# EAGLE design minDUINO v1.6 (EAGLE 6.3)
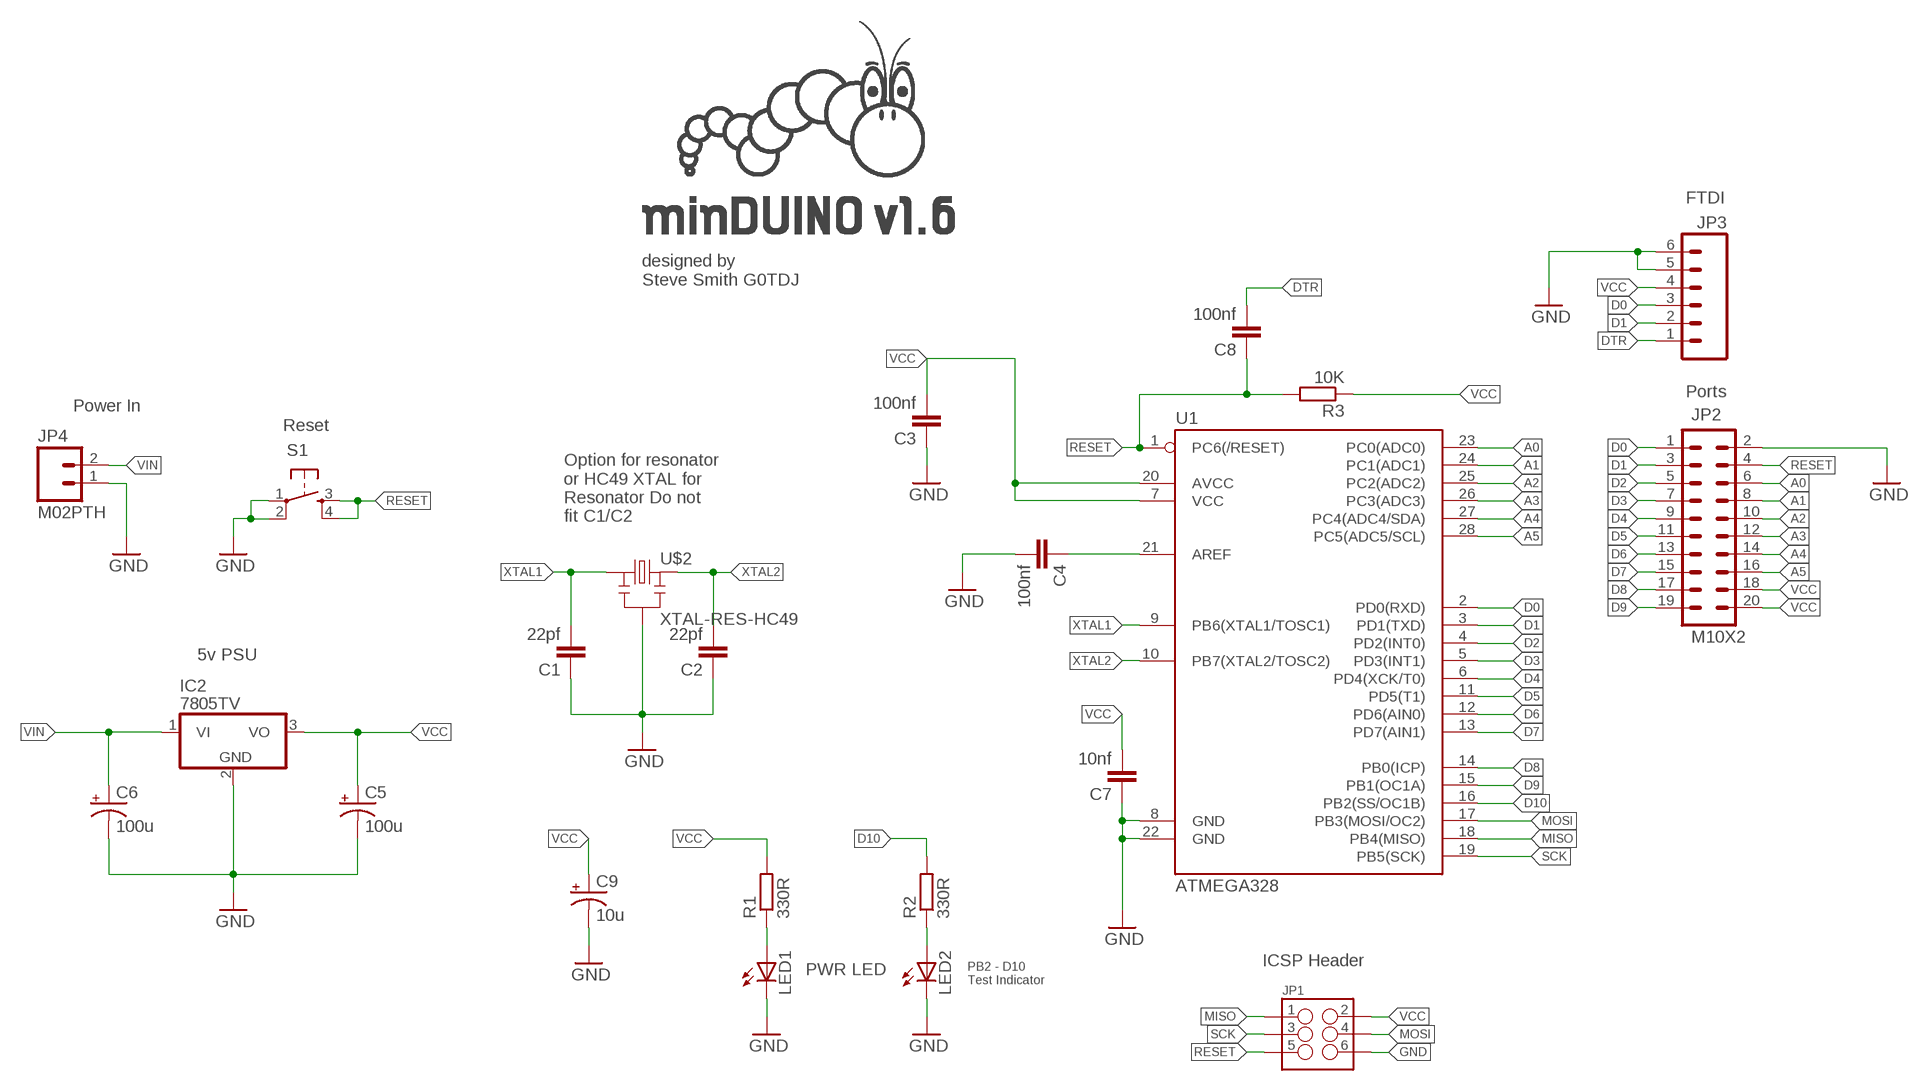
[diagram p0: schematic, sheet 1]

## Parts
C1  22pf  C-EU050-030X075  [C050-030X075]
C2  22pf  C-EU050-030X075  [C050-030X075]
C3  100nf  C-EU050-030X075  [C050-030X075]
C4  100nf  C-EU050-030X075  [C050-030X075]
C5  100u  CAP_POLPTH1  [CPOL-RADIAL-100UF-25V]
C6  100u  CAP_POLPTH1  [CPOL-RADIAL-100UF-25V]
C7  10nf  C-EU050-030X075  [C050-030X075]
C8  100nf  C-EU050-030X075  [C050-030X075]
C9  10u  CAP_POLPTH1  [CPOL-RADIAL-100UF-25V]
IC2  7805TV  [TO220V]
JP1  M03X2SHROUD  [2X3-SHROUDED]
JP2  M10X2  [2X10]
JP3  M06SIP  [1X06]
JP4  M02PTH  [1X02]
LED1  LED3MM  [LED3MM]
LED2  LED3MM  [LED3MM]
R1  330R  R-EU_0411/3V  [0411V]
R2  330R  R-EU_0411/3V  [0411V]
R3  10K  R-EU_0411/3V  [0411V]
S1  TAC_SWITCHPTH  [TACTILE-PTH]
U1  ATMEGA328  [DIL28-3]
U$1  MINDUINO_WORDMARK_V1.6  [MINDUINO_WORDMARK_V1.6]
U$2  XTAL-RES-HC49  [XTAL-RES-HC49]
U$4  MINDUINO_CATERPILLAR  [MINDUINO_CATERPILLAR]

## Nets
A0: JP2.6 U1.23(PC0(ADC0))
A1: JP2.8 U1.24(PC1(ADC1))
A2: JP2.10 U1.25(PC2(ADC2))
A3: JP2.12 U1.26(PC3(ADC3))
A4: JP2.14 U1.27(PC4(ADC4/SDA))
A5: JP2.16 U1.28(PC5(ADC5/SCL))
D0: JP2.1 JP3.3 U1.2(PD0(RXD))
D1: JP2.3 JP3.2 U1.3(PD1(TXD))
D2: JP2.5 U1.4(PD2(INT0))
D3: JP2.7 U1.5(PD3(INT1))
D4: JP2.9 U1.6(PD4(XCK/T0))
D5: JP2.11 U1.11(PD5(T1))
D6: JP2.13 U1.12(PD6(AIN0))
D7: JP2.15 U1.13(PD7(AIN1))
D8: JP2.17 U1.14(PB0(ICP))
D9: JP2.19 U1.15(PB1(OC1A))
D10: R2.2 U1.16(PB2(SS/OC1B))
DTR: C8.2 JP3.1
GND: C1.1 C2.1 C3.1 C4.2 C5.2(-) C6.2(-) C7.1 C9.2(-) IC2.2(GND) JP1.6 JP2.2 JP3.5 JP3.6 JP4.1 LED1.K(C) LED2.K(C) S1.1 S1.2 U1.8(GND) U1.22(GND) U$2.2
MISO: JP1.1 U1.18(PB4(MISO))
MOSI: JP1.4 U1.17(PB3(MOSI/OC2))
N$4: LED2.A R2.1
N$6: C4.1 U1.21(AREF)
N$23: LED1.A R1.1
RESET: C8.1 JP1.5 JP2.4 R3.2 S1.3 S1.4 U1.1(PC6(/RESET))
SCK: JP1.3 U1.19(PB5(SCK))
VCC: C3.2 C5.1(+) C7.2 C9.1(+) IC2.3(VO) JP1.2 JP2.18 JP2.20 JP3.4 R1.2 R3.1 U1.7(VCC) U1.20(AVCC)
VIN: C6.1(+) IC2.1(VI) JP4.2
XTAL1: C1.2 U1.9(PB6(XTAL1/TOSC1)) U$2.1
XTAL2: C2.2 U1.10(PB7(XTAL2/TOSC2)) U$2.3

## Notes on the sheet
- FTDI
- designed by
  Steve Smith G0TDJ
- Ports
- Power In
- Reset
- Option for resonator
  or HC49 XTAL for
  Resonator Do not
  fit C1/C2
- 5v PSU
- ICSP Header
- PWR LED
- PB2 - D10
  Test Indicator

## Library data of the parts
C1-C4 C7 C8 = resistor:C-EU: CAPACITOR, European symbol
C5 C6 C9 = SparkFun-Capacitors:CAP_POL: Capacitor Polarized These are standard SMD and PTH capacitors. Normally 10uF, 47uF, and 100uF in electrolytic and tantalum varieties. Always verify the external diameter of the through hole cap, it varies with capacity, voltage, and manufacturer. The EIA devices should be standard.
IC2 = linear:78*: Positive VOLTAGE REGULATOR Source: http://cache.national.com/ds/LM/LM78L05.pdf http://www.fairchildsemi.com/ds/LM/LM7805.pdf
JP1 = SparkFun-Connectors:M03X2: 2x3 .1" header. Shrouded, with keying- CONN-10681 SMT- CONN-11415 Pogo pins- HW-11044; PROD_ID: CONN-10681
JP2 = SparkFun-Connectors:M10X2: This was SPECIALLY designed to be used with our Graphic LCD Backpack. Be sure you want to use this! It is not only staggered on each line of header holes, but IT IS ALSO offset of the center point of the top and bottom lines by 5 mil. This causes the headers to lock into place on the "standard" footprint on the LCD screen. The extra squares on the tdocu layer are there simply to reference other pins (if you were to actually populate a longer header than ten long - this is what we do with the backpacks).
JP3 = SparkFun-Connectors:M06: Header 6 Standard 6-pin 0.1" header. Use with straight break away headers (SKU : PRT-00116), right angle break away headers (PRT-00553), swiss pins (PRT-00743), machine pins (PRT-00117), and female headers (PRT-00115). Molex polarized connector foot print use with SKU : PRT-08094 with associated crimp pins and housings. NOTES ON THE VARIANTS LOCK and LOCK_LONGPADS... This footprint was designed to help hold the alignment of a through-hole component (i.e. 6-pin header) while soldering it into place. You may notice that each hole has been shifted either up or down by 0.005 of an inch from it's more standard position (which is a perfectly straight line). This slight alteration caused the pins (the squares in the middle) to touch the edges of the holes. Because they are alternating, it causes a "brace" to hold the component in place. 0.005 has proven to be the perfect amount of "off-center" position when using our standard breakaway headers. Although looks a little odd when you look at the bare footprint, once you have a header in there, the alteration is very hard to notice. Also,if you push a header all the way into place, it is covered up entirely on the bottom side. This idea of altering the position of holes to aid alignment will be further integrated into the Sparkfun Library for other footprints. It can help hold any component with 3 or more connection pins.
JP4 = SparkFun-Connectors:M02: Standard 2-pin 0.1" header. Use with - straight break away headers ( PRT-00116) - right angle break away headers (PRT-00553) - swiss pins (PRT-00743) - machine pins (PRT-00117) - female headers (PRT-00115) Molex polarized connector foot print use with: PRT-08233 with associated crimp pins and housings. 2.54_SCREWTERM for use with PRT-10571. 3.5mm Screw Terminal footprints for PRT-08084 5mm Screw Terminal footprints for use with PRT-08433
LED1 LED2 = SparkFun-LED:LED: LEDs Standard schematic elements and footprints for 5mm, 3mm, 1206, and 0603 sized LEDs. 5mm - Spark Fun Electronics SKU : COM-00529 (and others)
R1-R3 = resistor:R-EU_: RESISTOR, European symbol
S1 = SparkFun-Electromechanical:TAC_SWITCH: Momentary Switch Button commonly used for reset or general input. Spark Fun Electronics SKU : COM-00097 SMT- SWCH-08247
U1 = 00_G0TDJ:ATMEGA328: uC used in the Arduino 32k flash, 1k EPROM, 2k SRAM Through hole version with extra wide holes for ZIF Socket
U$1 = 00_G0TDJ:MINDUINO_WORDMARK_V1.6
U$2 = 00_G0TDJ:XTAL-RES-HC49: Resonator footprint with HC49 outline
U$4 = 00_G0TDJ:MINDUINO_CATERPILLAR

## Board
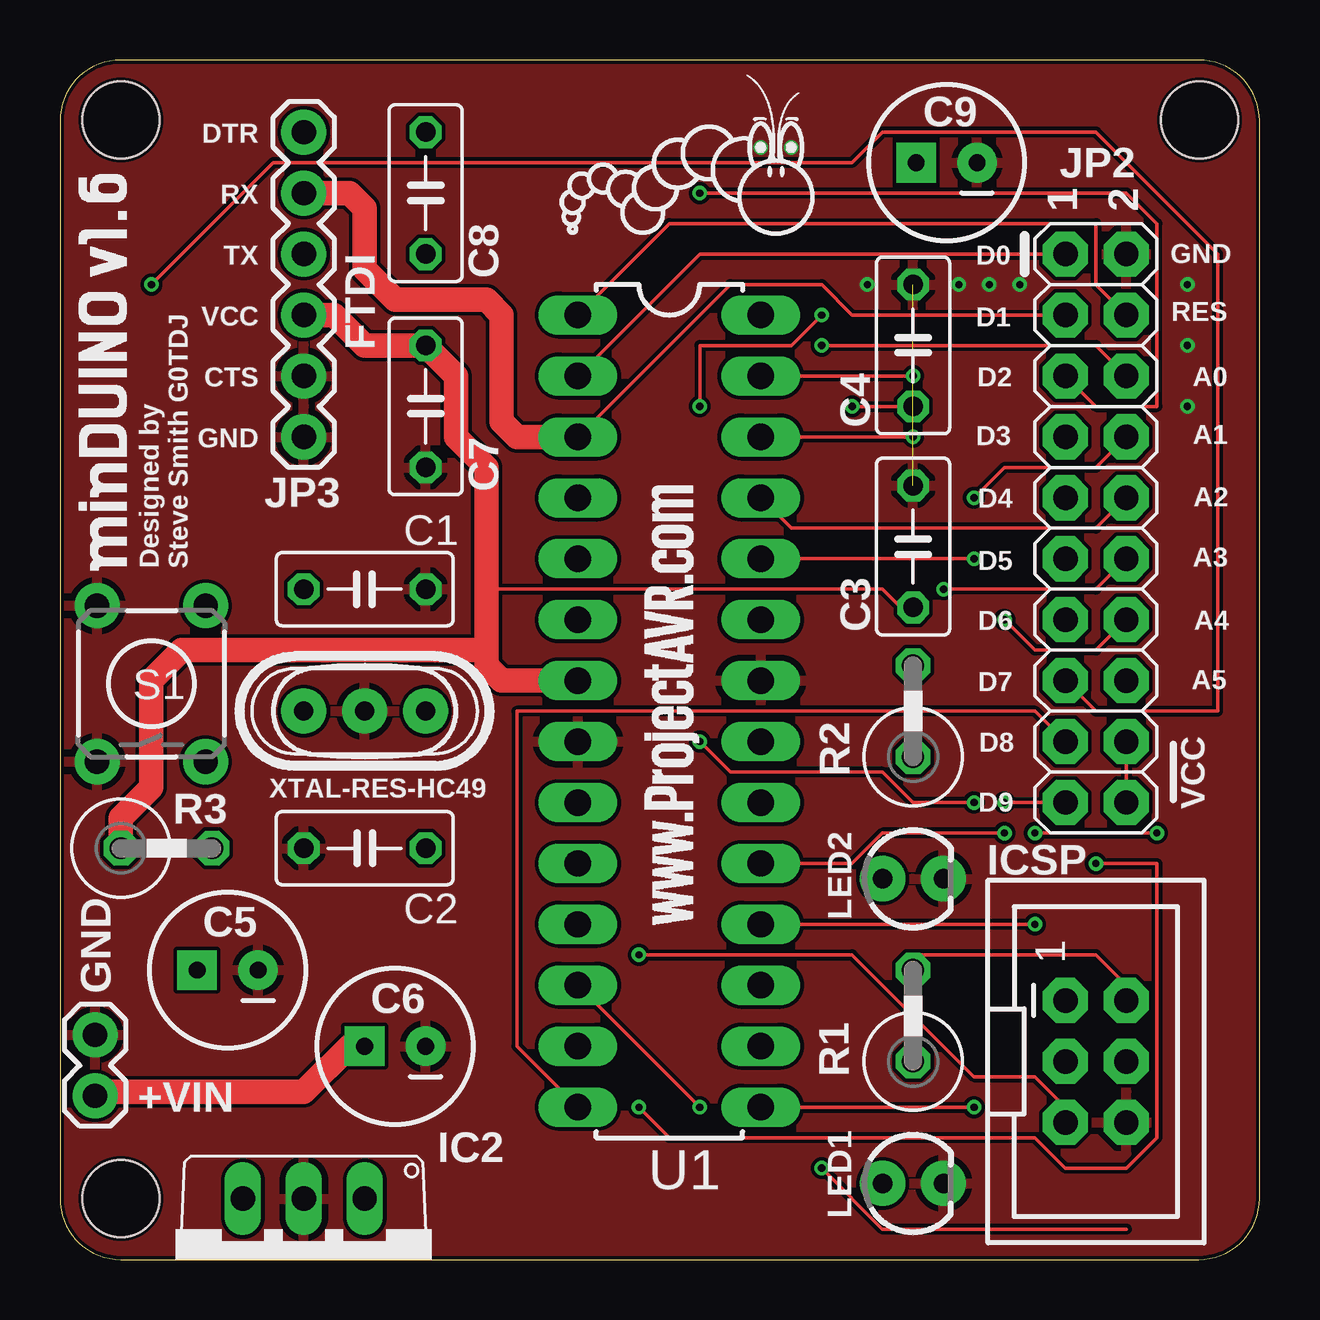
[diagram p1: board, top side]
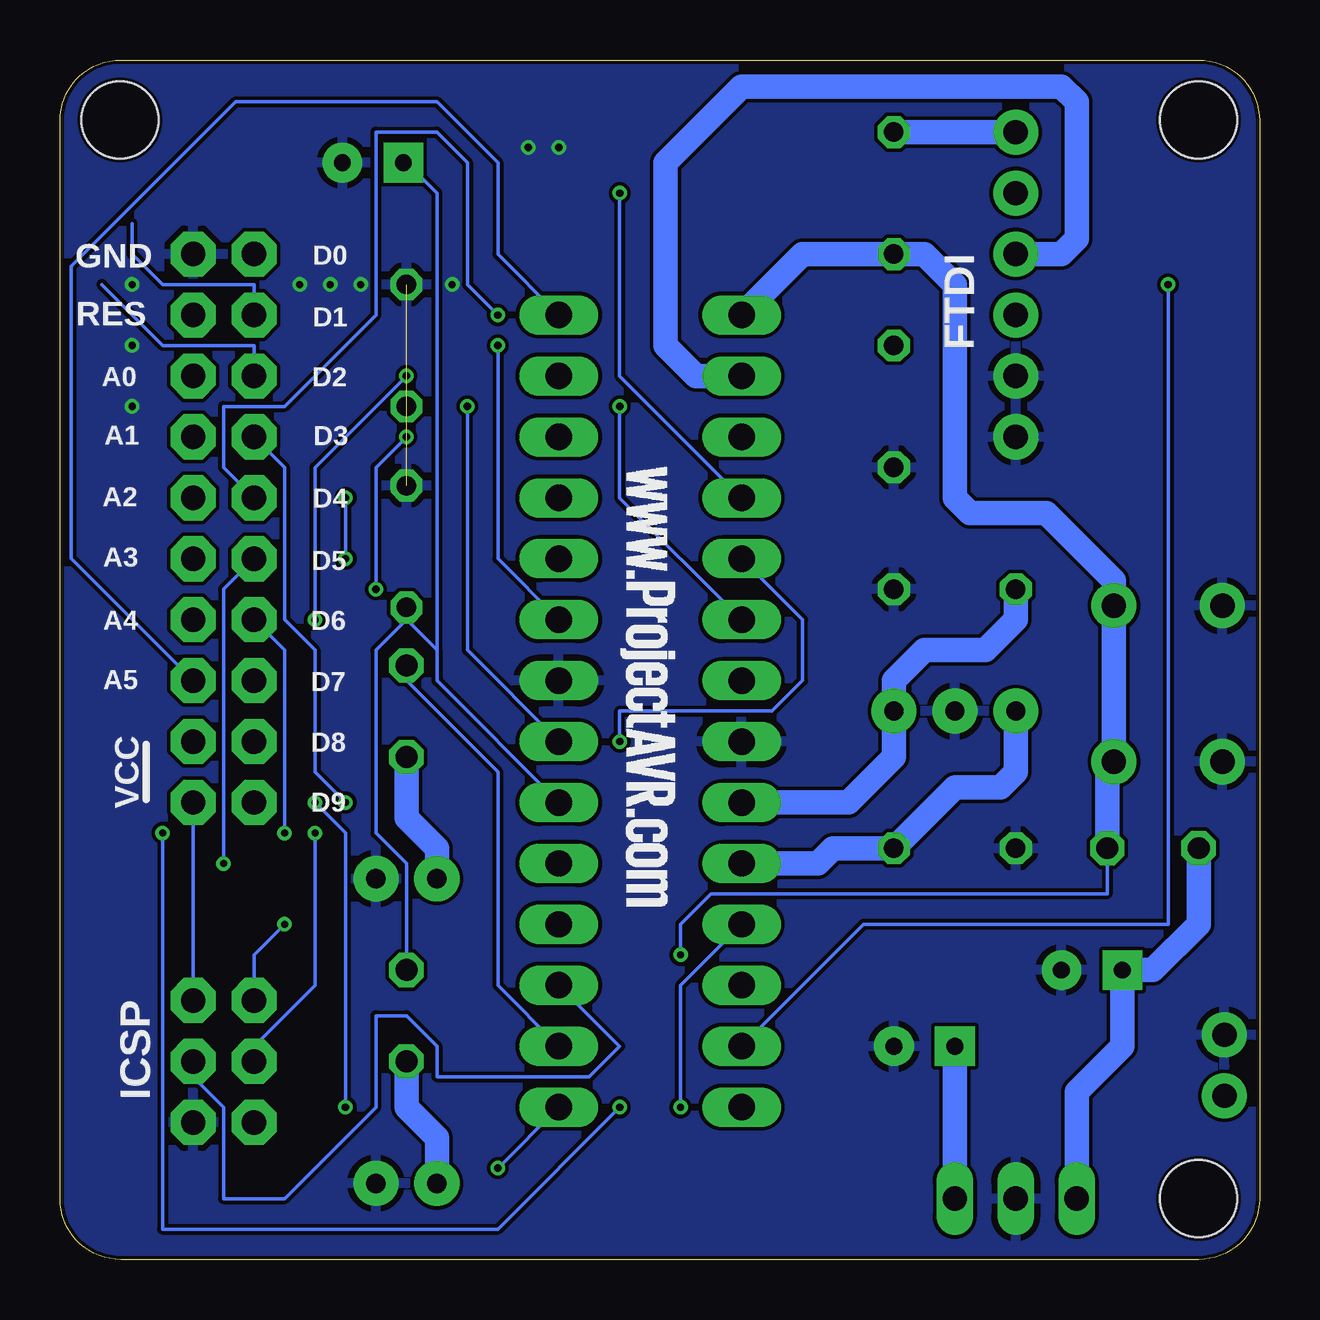
[diagram p2: board, bottom side, seen from below]

Size 50 x 50 mm. Coordinates in mm from the lower left corner, seen from the top.
Outline: 0,47.46 0,2.54 arc90 2.54,0 47.46,0 arc90 50,2.54 50,47.46 arc90 47.46,50 2.54,50 arc90 0,47.46
Copper layers (1*16): Top 0.035mm / dielectric 1.5mm / Bottom 0.035mm
Design rules "hackvana": minimum track width 6mil, minimum drill 0.3mm, track to track 6mil, track to pad 6mil, pad to pad 6mil, via to via 6mil, smd to smd 0mil, copper to edge 6mil, drill to drill 6mil, minimum pad ring 10mil, minimum via ring 6mil, stop-mask expansion 2mil, vias tented up to drill 100mil, thermal gap 10mil
Holes 3.2 mm at 2.54,2.54 47.5,47.5 2.54,47.5

### Footprints (pad centres in the part's own frame; a part is rotated, then mirrored left to right if it is on the bottom)
C050-030X075 = drill 0.813 octagon: 1 -2.54,0; 2 2.54,0
CPOL-RADIAL-100UF-25V = drill 0.7 pad 1.651 square: 1 1.27,0 | drill 0.7 pad 1.651: 2 -1.27,0
TO220V = drill 1.016 long: 1 -2.54,-2.54; 2 0,-2.54; 3 2.54,-2.54
2X3-SHROUDED = drill 1.016 pad 1.88 octagon: 1 -1.27,2.54; 2 1.27,2.54; 3 -1.27,0; 4 1.27,0; 5 -1.27,-2.54; 6 1.27,-2.54
2X10 = drill 1.016 pad 1.88 octagon: 1 -11.43,-1.27; 2 -11.43,1.27; 3 -8.89,-1.27; 4 -8.89,1.27; 5 -6.35,-1.27; 6 -6.35,1.27; 7 -3.81,-1.27; 8 -3.81,1.27; 9 -1.27,-1.27; 10 -1.27,1.27; 11 1.27,-1.27; 12 1.27,1.27; 13 3.81,-1.27; 14 3.81,1.27; 15 6.35,-1.27; 16 6.35,1.27; 17 8.89,-1.27; 18 8.89,1.27; 19 11.43,-1.27; 20 11.43,1.27
1X06 = drill 1.016 pad 1.88: 1 0,0; 2 2.54,0; 3 5.08,0; 4 7.62,0; 5 10.16,0; 6 12.7,0
1X02 = drill 1.016 pad 1.88: 1 0,0; 2 2.54,0
LED3MM = drill 0.813 pad 1.88: A -1.27,0; K 1.27,0
0411V = drill 0.914 octagon: 1 -2.54,0; 2 1.27,0
TACTILE-PTH = drill 1.016 pad 1.88: 1 -3.251,2.261; 2 3.251,2.261; 3 -3.251,-2.261; 4 3.251,-2.261
DIL28-3 = drill 1.1 long: 1 -16.51,-3.81; 2 -13.97,-3.81; 3 -11.43,-3.81; 4 -8.89,-3.81; 5 -6.35,-3.81; 6 -3.81,-3.81; 7 -1.27,-3.81; 8 1.27,-3.81; 9 3.81,-3.81; 10 6.35,-3.81; 11 8.89,-3.81; 12 11.43,-3.81; 13 13.97,-3.81; 14 16.51,-3.81; 15 16.51,3.81; 16 13.97,3.81; 17 11.43,3.81; 18 8.89,3.81; 19 6.35,3.81; 20 3.81,3.81; 21 1.27,3.81; 22 -1.27,3.81; 23 -3.81,3.81; 24 -6.35,3.81; 25 -8.89,3.81; 26 -11.43,3.81; 27 -13.97,3.81; 28 -16.51,3.81
XTAL-RES-HC49 = drill 0.8 pad 1.88: 1 -2.54,0; 2 0,0; 3 2.54,0

### Placement (x,y rotation side)
C1  12.7,27.94 180 top
C2  12.7,17.14 0 top
C3  35.56,29.72 270 top
C4  35.56,38.1 90 top
C5  6.99,12.06 180 top
C6  13.97,8.89 180 top
C7  15.24,35.56 90 top
C8  15.24,44.45 90 top
C9  36.96,45.72 180 top
IC2  10.16,0 180 top
JP1  43.18,8.26 0 top
JP2  43.18,30.48 270 top
JP3  10.16,46.99 270 top
JP4  1.46,9.36 270 top
LED1  35.56,3.17 0 top
LED2  35.56,15.88 0 top
R1  35.56,10.79 90 top
R2  35.56,23.5 90 top
R3  5.08,17.14 0 top
S1  3.81,24 90 top
U1  25.4,22.86 270 top
U$1  2.79,28.7 90 top
U$2  12.7,22.86 180 top
U$3  [PROJECTAVR_LOGO_1]  26.67,33.02 270 bottom
U$4  20.84,42.53 0 top
U$5  [PROJECTAVR_LOGO_1]  26.67,13.97 90 top

### Tracks (layer width: path | path; a pad name or v marks a point on that pad's centre or on a via)
A0  (via drill 0.3)
  Top 0.152: v31.75,38.1 43.18,38.1 JP2.6
  Bottom 0.152: U1.23 31.75,29.21 v31.75,38.1
A1  (via drill 0.3)
  Top 0.152: v38.1,29.21 U1.24 | v38.1,31.75 39.37,33.02 43.18,33.02 JP2.8
  Bottom 0.152: v38.1,31.75 v38.1,29.21
A2
  Top 0.152: U1.25 30.48,30.48 43.18,30.48 JP2.10
A3  (via drill 0.3)
  Top 0.152: v35.56,34.29 U1.26 | v36.83,27.94 43.18,27.94 JP2.12
  Bottom 0.152: v35.56,34.29 36.83,33.02 v36.83,27.94
A4  (via drill 0.3)
  Top 0.152: v35.56,36.83 U1.27 | v39.37,26.67 40.64,25.4 43.18,25.4 JP2.14
  Bottom 0.152: v35.56,36.83 39.37,33.02 v39.37,26.67
A5
  Bottom 0.152: U1.28 31.75,41.91 31.75,45.72 34.29,48.26 42.67,48.26 49.53,41.4 49.53,29.21 JP2.16
D0
  Top 0.152: JP2.1 26.67,41.91 U1.2
  Bottom 1.016: U1.2 23.5,36.83 24.77,38.1 24.77,45.72 21.59,48.9 8.26,48.9 7.62,48.26 7.62,42.55 8.26,41.91 JP3.3
D1
  Top 0.152: JP2.3 33.02,39.37 31.75,40.64 27.94,40.64 U1.3
  Top 1.016: JP3.2 12.06,44.45 12.7,43.81 12.7,41.27 13.97,40.01 17.78,40.01 18.41,39.37 18.41,34.92 19.05,34.29 U1.3
  Bottom 0.152: 46.99,43.18 46.99,41.91 45.72,40.64 41.91,40.64 JP2.3
D2  (via drill 0.3)
  Top 0.152: v26.67,44.45 44.45,44.45 45.72,43.18 45.72,35.56 43.18,35.56 JP2.5
  Bottom 0.152: U1.4 26.67,36.83 v26.67,44.45 | 48.26,40.64 45.72,38.1 41.91,38.1 JP2.5
D3  (via drill 0.3)
  Top 0.152: v26.67,21.59 27.94,20.32 34.29,20.32 35.56,19.05 v38.1,19.05
  Bottom 0.152: U1.5 19.05,26.67 19.05,24.13 20.32,22.86 26.67,22.86 v26.67,21.59 | v38.1,19.05 39.37,20.32 39.37,25.4 40.64,26.67 40.64,33.02 JP2.7
D4  (via drill 0.3)
  Top 0.152: v26.67,35.56 26.67,38.1 30.48,38.1 v31.75,39.37
  Bottom 0.152: U1.6 26.67,31.75 v26.67,35.56 | v31.75,39.37 33.02,40.64 33.02,45.72 34.29,46.99 36.83,46.99 36.83,39.37 40.64,35.56 43.18,35.56 43.18,33.02 JP2.9
D5  (via drill 0.3)
  Top 0.152: v24.13,6.35 25.4,5.08 40.64,5.08 41.91,3.81 44.45,3.81 45.72,5.08 45.72,16.51 v43.18,16.51
  Bottom 0.152: U1.11 24.13,11.43 v24.13,6.35 | v43.18,16.51 43.18,27.94 JP2.11
D6  (via drill 0.3)
  Top 0.152: v26.67,6.35 U1.12 | v40.64,17.78 v45.72,17.78
  Bottom 0.152: v26.67,6.35 31.75,1.27 45.72,1.27 v45.72,17.78 | v40.64,17.78 40.64,25.4 JP2.13
D7  (via drill 0.3)
  Top 0.152: v3.81,40.64 8.89,45.72 33.02,45.72 34.29,46.99 43.18,46.99 48.26,41.91 48.26,22.86 43.18,22.86 JP2.15
  Bottom 0.152: U1.13 16.51,13.97 3.81,13.97 v3.81,40.64
D8
  Top 0.152: U1.14 19.05,8.89 19.05,22.86 40.64,22.86 JP2.17
D9  (via drill 0.3)
  Top 0.152: v31.75,3.81 34.29,1.27 44.45,1.27 | v39.37,19.05 JP2.19 | U1.15 v38.1,6.35
  Bottom 0.152: v31.75,3.81 U1.15 | v39.37,19.05 38.1,17.78 v38.1,6.35
D10
  Bottom 0.152: U1.16 31.75,11.43 31.75,20.32 35.56,24.13 R2.2
DTR
  Bottom 1.016: JP3.1 C8.2
GND  (via drill 0.3)  (1 unrouted)
  other vias: 40.01,40.64 46.99,40.64 46.99,38.1 46.99,35.56 38.73,40.64 37.47,40.64 29.21,46.35 30.48,46.35 33.66,40.64
  pour Top: 0,46.99 0,2.54 arc90 2.54,0 48.26,0 arc81 50.04,1.52 50.04,47.5 arc90 47.5,50.04 2.29,50.04 arc106
  pour Bottom: 0,48.26 0,2.54 arc90 2.54,0 48.26,0 arc98 50.04,2.03 50.04,47.24 50.04,47.5 arc90 47.5,50.04 2.29,50.04 1.78,50.04 arc90
MISO  (via drill 0.3)
  Top 0.152: v40.64,13.97 U1.18
  Bottom 0.152: v40.64,13.97 41.91,12.7 JP1.1
MOSI
  Bottom 0.152: U1.17 26.67,8.89 27.94,7.62 34.29,7.62 34.29,8.89 35.56,10.16 36.83,10.16 36.83,6.35 40.64,2.54 43.18,2.54 43.18,6.35 44.45,7.62 JP1.4
N$4
  Bottom 1.016: LED2.A 34.29,17.14 35.56,18.41 R2.1
N$6  (via drill 0.3)
  Top 0.152: v33.02,35.56 C4.1
  Bottom 0.152: v33.02,35.56 33.02,25.4 U1.21
N$23
  Bottom 1.016: LED1.A 34.29,5.08 35.56,6.35 R1.1
RESET  (via drill 0.3)
  Top 0.152: v24.13,12.7 33.02,12.7 38.1,7.62 40.64,7.62 41.91,6.35 JP1.5 | JP2.4 43.18,40.64 43.18,43.18 25.4,43.18 U1.1
  Bottom 0.152: v24.13,12.7 24.13,13.97 22.86,15.24 6.35,15.24 R3.2
  Bottom 1.016: R3.2 6.35,20.47 S1.3 S1.4 6.07,28.3 8.89,31.11 12.06,31.11 12.7,31.75 12.7,40.64 13.97,41.91 C8.1 19.05,41.91 U1.1
SCK  (via drill 0.3)
  Top 0.152: U1.19 33.02,16.51 34.29,17.78 v39.37,17.78
  Bottom 0.152: v39.37,17.78 39.37,11.43 41.91,8.89 JP1.3
VCC
  Top 0.152: JP2.18 JP2.20 | R1.2 35.56,12.7 43.18,12.7 44.45,11.43 JP1.2 | 17.78,27.94 34.29,27.94 35.56,26.67 C3.2
  Top 1.016: JP3.4 11.43,39.37 12.7,38.1 C7.2 16.51,36.83 16.51,34.29 17.78,33.02 17.78,27.94 17.78,25.4 | 17.78,25.4 17.78,24.77 18.41,24.13 U1.7 | R3.1 2.54,18.41 3.81,19.68 3.81,24.13 5.08,25.4 17.78,25.4
  Bottom 0.152: JP1.2 JP2.20 | U1.20 34.29,24.13 34.29,25.4 | 35.56,26.67 34.29,25.4 | 34.29,25.4 34.29,44.45 35.56,45.72 C9.1 | R1.2 35.56,16.51 36.83,17.78 36.83,25.4 35.56,26.67 | 35.56,26.67 C3.2
  Bottom 1.016: IC2.3 7.62,6.99 5.71,8.89 C5.1 4.45,12.06 2.54,13.97 R3.1
VIN
  Top 1.016: C6.1 12.06,8.89 10.16,6.99 1.62,6.99 JP4.2
  Bottom 1.016: IC2.1 C6.1
XTAL1
  Bottom 1.016: U1.9 17.14,19.05 15.24,20.95 U$2.1 15.24,24.13 13.97,25.4 11.43,25.4 10.16,26.67 C1.2
XTAL2
  Bottom 1.016: U1.10 18.41,16.51 17.78,17.14 C2.2 12.7,19.68 10.79,19.68 10.16,20.32 U$2.3

### Text on the board
tPlace: DTR | RX | 1 | 2 | FTDI | GND | TX | D0 | RES | VCC | D1 | CTS | D2 | A0 | GND | D3 | A1 | D4 | A2 | D5 | A3 | D6 | A4 | D7 | A5 | VCC | D8 | D9 | ICSP | GND | +VIN
bPlace: FTDI | GND | D0 | RES | D1 | D2 | A0 | D3 | A1 | D4 | A2 | D5 | A3 | D6 | A4 | D7 | A5 | VCC | D8 | D9 | ICSP
tNames: Designed by / Steve Smith G0TDJ